# EAGLE design Rocky Switch Relay (EAGLE 8.2.1)
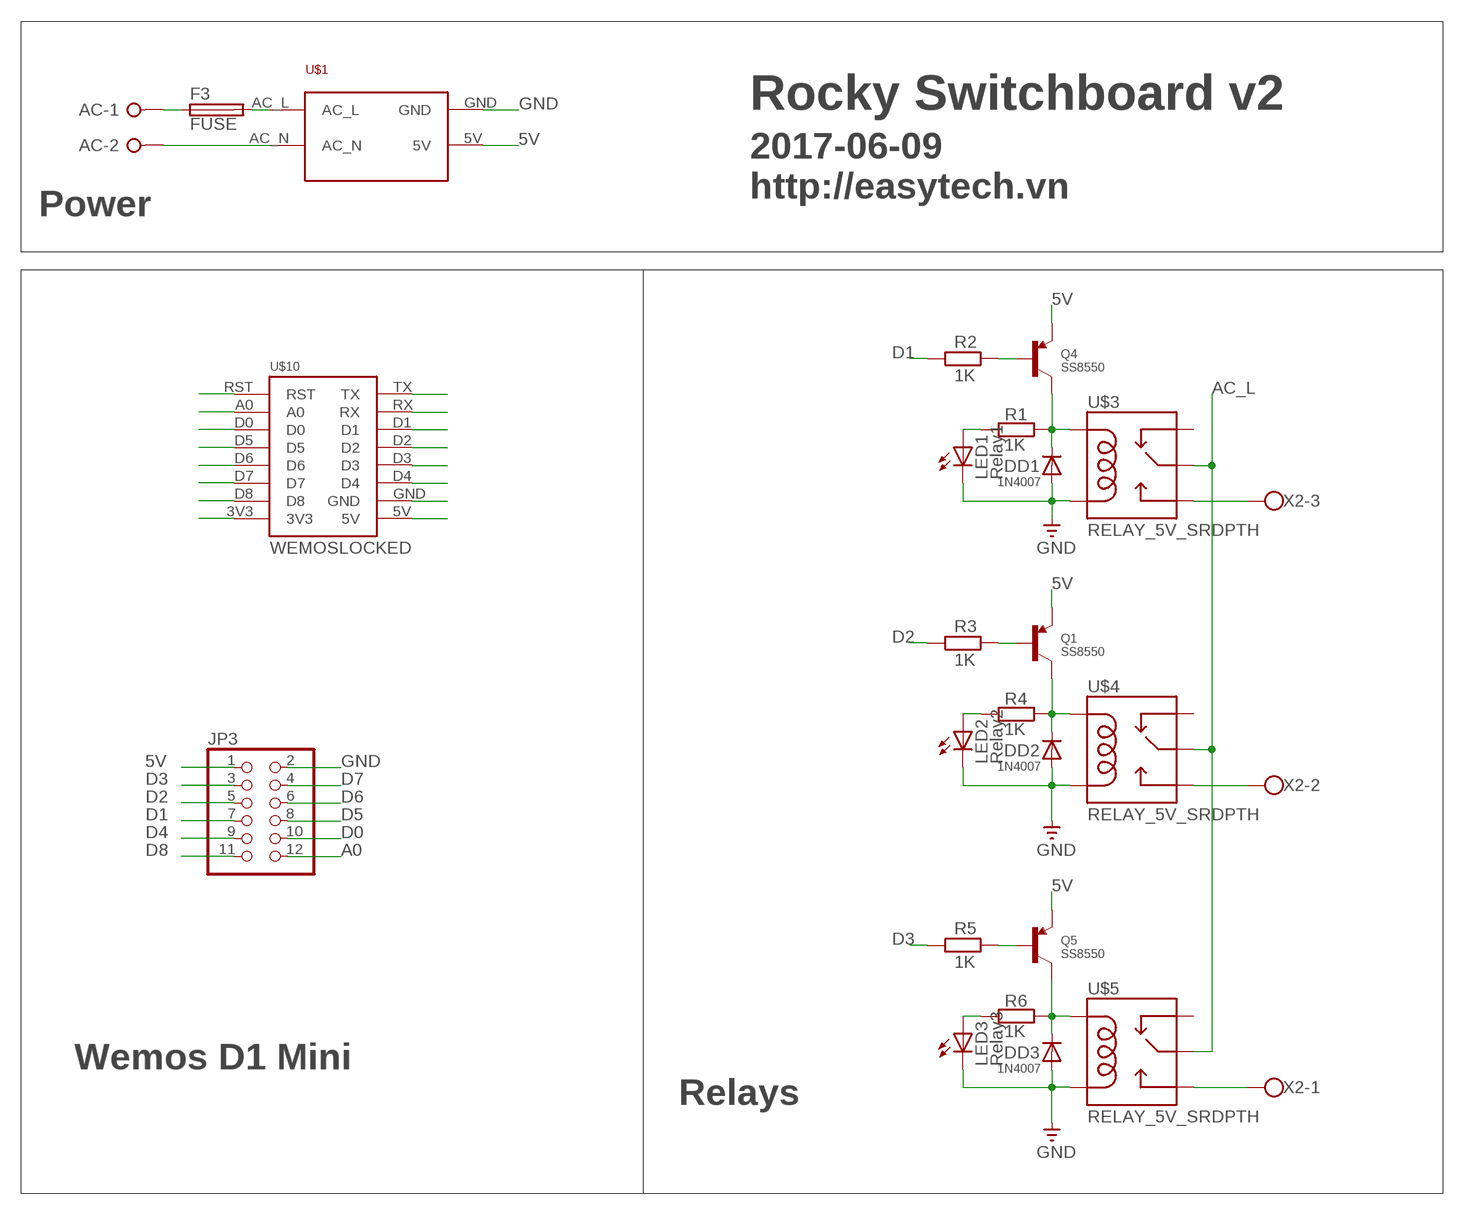
[diagram p0: schematic, sheet 1]

## Parts
AC  W237-02P  [W237-132]
DD1  1N4007  DIODESMA  [SMADIODE]
DD2  1N4007  DIODESMA  [SMADIODE]
DD3  1N4007  DIODESMA  [SMADIODE]
F3  FUSE  FUSETE5  [TE5]
JP3  PINHD-2X6  [2X06]
LED1  Relay1  LEDCHIP-LED0805  [CHIP-LED0805]
LED2  Relay2  LEDCHIP-LED0805  [CHIP-LED0805]
LED3  Relay3  LEDCHIP-LED0805  [CHIP-LED0805]
Q1  SS8550  TRANSISTOR_PNPSOT23-WAVE  [SOT23-W]
Q4  SS8550  TRANSISTOR_PNPSOT23-WAVE  [SOT23-W]
Q5  SS8550  TRANSISTOR_PNPSOT23-WAVE  [SOT23-W]
R1  1K  R-EU_R0805  [R0805]
R2  1K  R-EU_R0805  [R0805]
R3  1K  R-EU_R0805  [R0805]
R4  1K  R-EU_R0805  [R0805]
R5  1K  R-EU_R0805  [R0805]
R6  1K  R-EU_R0805  [R0805]
U$1  POWER_SUPPLY_220VAC_5V  [POWER_SUPPLY_220VAC_5V]
U$3  RELAY_5V_SRDPTH  [SRD-05VDC-SL-C]
U$4  RELAY_5V_SRDPTH  [SRD-05VDC-SL-C]
U$5  RELAY_5V_SRDPTH  [SRD-05VDC-SL-C]
U$10  WEMOSLOCKED  [WEMOS_LOCKED]
X2  W237-103  [W237-103]

## Nets
3V3: U$10.3V3
5V: JP3.1 Q1.2(E) Q4.2(E) Q5.2(E) U$1.5V U$10.5V
A0: JP3.12 U$10.A0
AC_L: F3.2 U$1.AC_L U$3.SWCOMMON U$4.SWCOMMON U$5.SWCOMMON
AC_N: AC.2 U$1.AC_N
D0: JP3.10 U$10.D0
D1: JP3.7 R2.1 U$10.D1
D2: JP3.5 R3.1 U$10.D2
D3: JP3.3 R5.1 U$10.D3
D4: JP3.9 U$10.D4
D5: JP3.8 U$10.D5
D6: JP3.6 U$10.D6
D7: JP3.4 U$10.D7
D8: JP3.11 U$10.D8
GND: DD1.A DD2.A DD3.A JP3.2 LED1.C LED2.C LED3.C U$1.GND U$3.COIL0 U$4.COIL0 U$5.COIL0 U$10.GND
N$1: DD2.C Q1.3(C) R4.1 U$4.COIL1
N$3: U$3.SWOPEN X2.3
N$4: LED1.A R1.2
N$5: DD3.C Q5.3(C) R6.1 U$5.COIL1
N$6: Q1.1(B) R3.2
N$7: Q4.1(B) R2.2
N$8: LED2.A R4.2
N$9: U$4.SWOPEN X2.2
N$11: Q5.1(B) R5.2
N$12: LED3.A R6.2
N$13: U$5.SWOPEN X2.1
N$14: AC.1 F3.1
N$20: DD1.C Q4.3(C) R1.1 U$3.COIL1
RST1: U$10.RST
RX: U$10.RX
TX: U$10.TX
Unconnected: U$3.SWCLOSED(SWCLOSE) U$4.SWCLOSED(SWCLOSE) U$5.SWCLOSED(SWCLOSE)

## Notes on the sheet
- Rocky Switchboard v2
- 2017-06-09
  http://easytech.vn
- Power
- Wemos D1 Mini
- Relays

## Library data of the parts
AC = con-wago-508:W237-02P: WAGO SREW CLAMP; OC_FARNELL: unknown; OC_NEWARK: unknown
DD1-DD3 = adafruit:DIODE: Diode SMADIODE - SMA Surface Mount Package 20V 1A Schottky Diode Digikey: 641-1014-6-ND DO-1N4148 - Through Hole Small Current Diode SOD-123 20V 1 A (.5mV Vf) Schottky Diode - Digikey: MBRX120TPMSCT-ND SOD-323 10V 570mA (.38mV Vf, 3ns) Schottky Diode - Digikey: ZLLS410CT-ND SOD-523 30V 30mA Schottky Diode (RB751S-40TE61) - Digikey: RB751S-40TE61CT-ND SOT23-R/W - SOT23 Package (R = Solder Paste/Reflow Ovens, W = Hand-Soldering) BAT54Film 40V 300mA - Digikey: 497-7162-1-ND
F3 = fuse:FUSE: Fuse; OC_FARNELL: unknown; OC_NEWARK: unknown
JP3 = pinhead:PINHD-2X6: PIN HEADER
LED1-LED3 = adafruit:LED: LED OSRAM: - CHIPLED LG R971, LG N971, LY N971, LG Q971, LY Q971, LO R971, LY R971 LH N974, LH R974 LS Q976, LO Q976, LY Q976 LO Q996 - Hyper CHIPLED LW Q18S LB Q993, LB Q99A, LB R99A - SideLED LS A670, LO A670, LY A670, LG A670, LP A670 LB A673, LV A673, LT A673, LW A673 LH A674 LY A675 LS A676, LA A676, LO A676, LY A676, LW A676 LS A679, LY A679, LG A679 - Hyper Micro SIDELED® LS Y876, LA Y876, LO Y876, LY Y876 LT Y87S - SmartLED LW L88C, LW L88S LB L89C, LB L89S, LG L890 LS L89K, LO L89K, LY L89K LS L896, LA L896, LO L896, LY L896 - TOPLED LS T670, LO T670, LY T670, LG T670, LP T670 LSG T670, LSP T670, LSY T670, LOP T670, LYG T670 LG T671, LOG T671, LSG T671 LB T673, LV T673, LT T673, LW T673 LH T674 LS T676, LA T676, LO T676, LY T676, LB T676, LH T676, LSB T676, LW T676 LB T67C, LV T67C, LT T67C, LS T67K, LO T67K, LY T67K, LW E67C LS E67B, LA E67B, LO E67B, LY E67B, LB E67C, LV E67C, LT E67C LW T67C LS T679, LY T679, LG T679 LS T770, LO T770, LY T770, LG T770, LP T770 LB T773, LV T773, LT T773, LW T773 LH T774 LS E675, LA E675, LY E675, LS T675 LS T776, LA T776, LO T776, LY T776, LB T776 LHGB T686 LT T68C, LB T68C - Hyper Mini TOPLED® LB M676 - Mini TOPLED Santana® LG M470 LS M47K, LO M47K, LY M47K Source: http://www.osram.convergy.de/
Q1 Q4 Q5 = microbuilder:TRANSISTOR_PNP: PNP Transistor Transistor (PNP) 800mA 60V, 1.6V VCE @ 500mA [Digikey: MMBT2907AFSTR-ND] Transistor (PNP) Low Sat - 1.5A 20V, 260mV VCE @ 400mA [Digikey: ZXTP25020DFLTR-ND] SOT23-R - SOT23 footprint optimised for use with solder paste and reflow ovens. SOT23-W - SOT23 footprint optimised for hand-soldering (larger pads).
R1-R6 = rcl:R-EU_: RESISTOR, European symbol
U$1 = My Eagle Lib:POWER_SUPPLY_220VAC_5V
U$3-U$5 = My-Eagle-Lib:RELAY_5V_SRD: SPDT relay (COM-00101)
U$10 = My Eagle Lib:WEMOS
X2 = con-wago-500:W237-103: WAGO SCREW CLAMP; MPN: 237-103; OC_FARNELL: unknown; OC_NEWARK: 18M7116

## Board
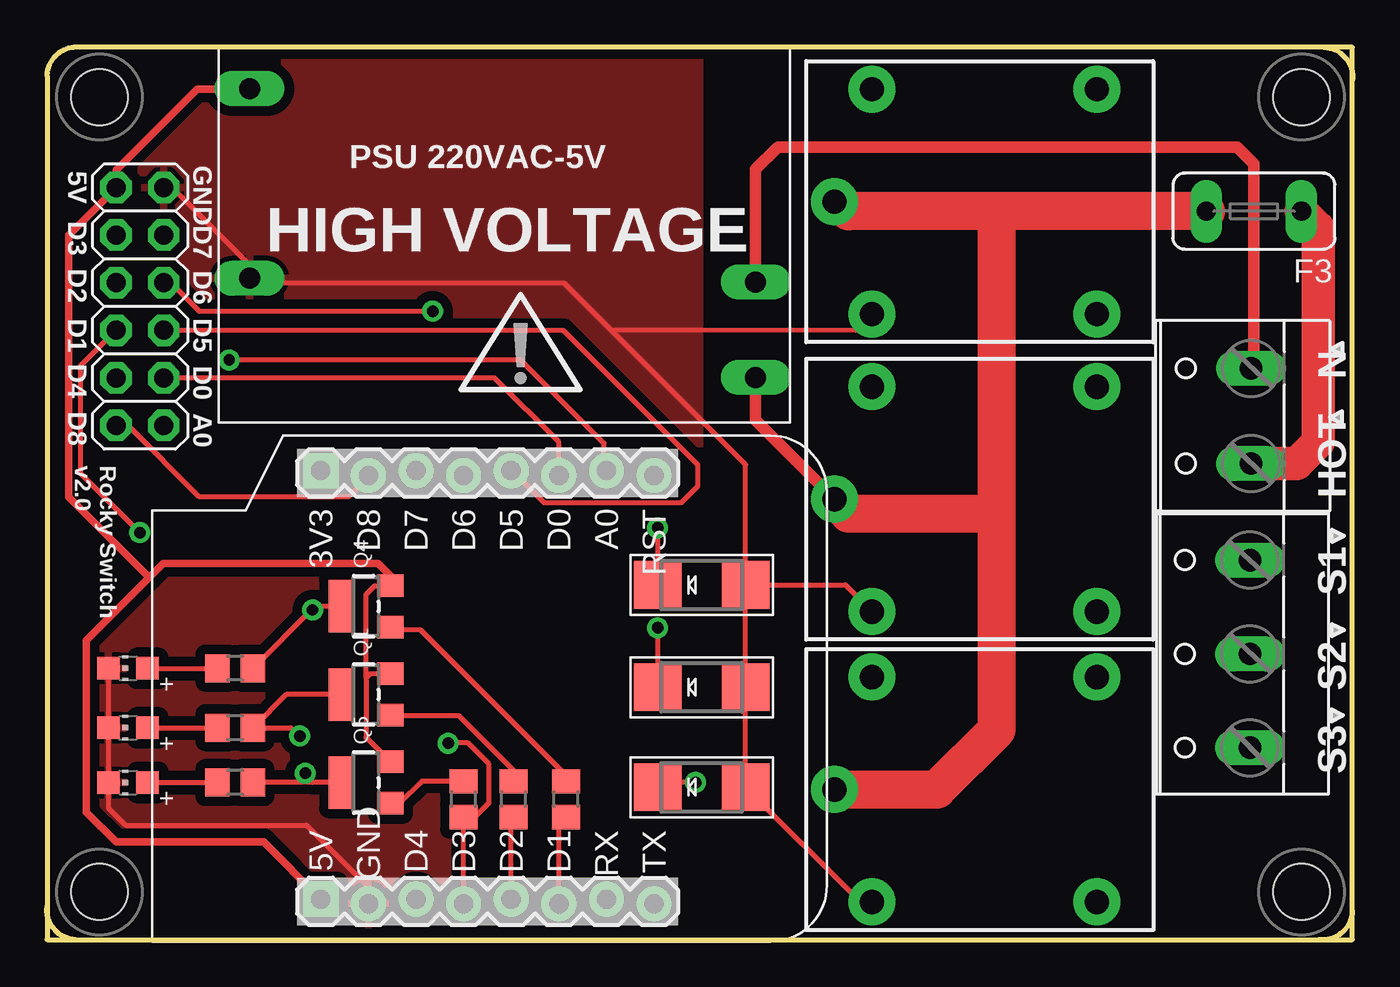
[diagram p1: board, top side]
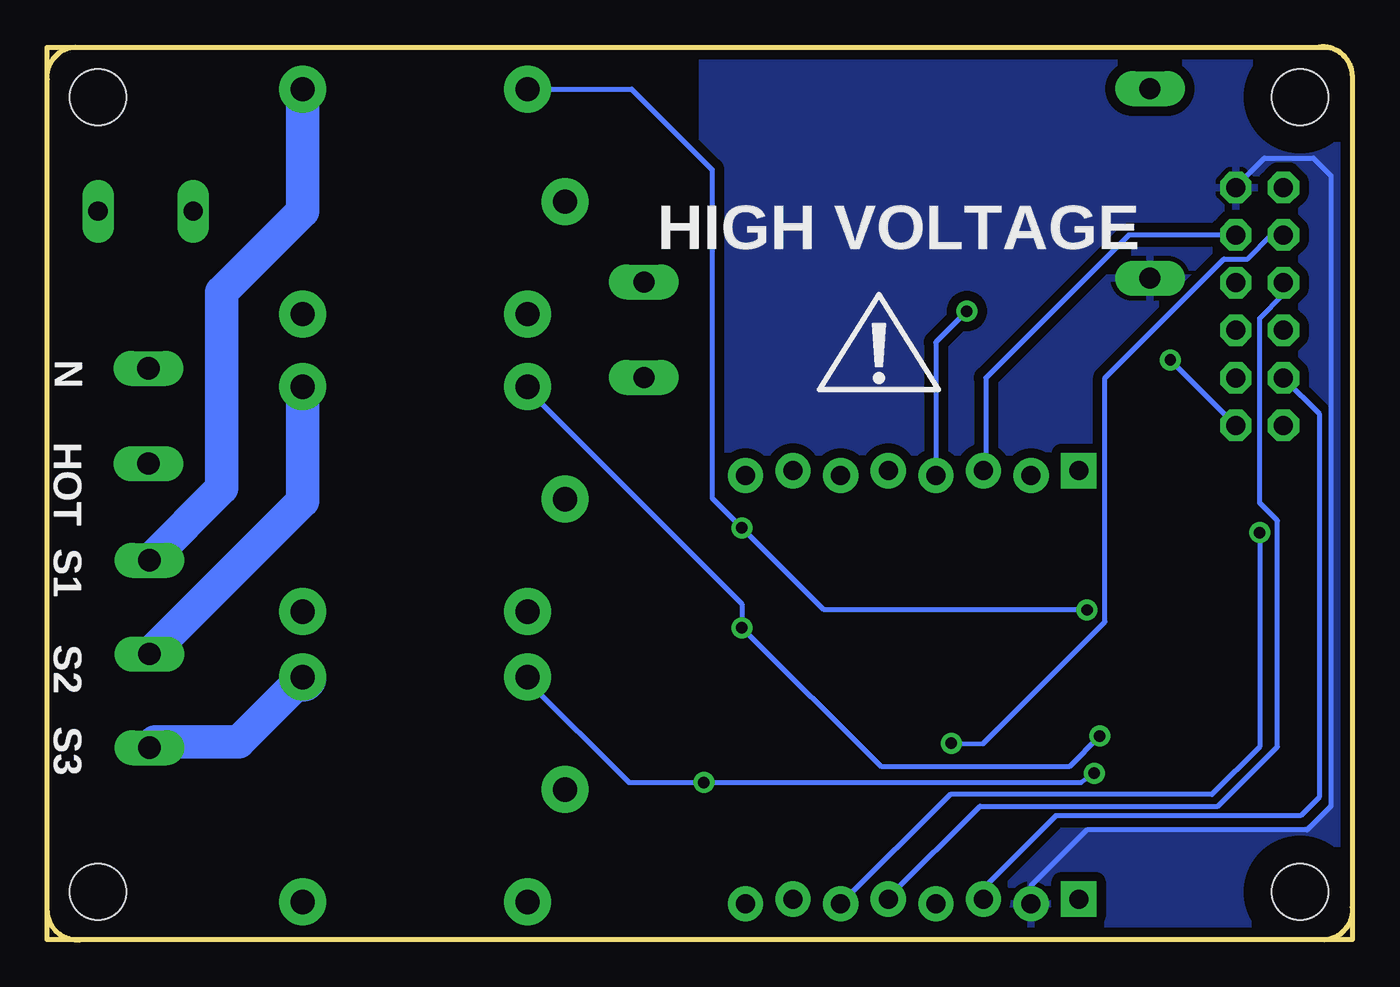
[diagram p2: board, bottom side, seen from below]

Size 69.67 x 47.65 mm. Coordinates in mm from the lower left corner, seen from the top.
Outline: 1.53,0.01 0.01,0.01 0.01,1.79
Outline: 1.53,0.01 67.88,0.01
Outline: 67.88,0.01 69.66,0.01 69.66,47.63 1.41,47.63
Outline: 0.01,1.79 0.01,46.11 arc-95 1.79,47.64
Outline: 68.13,47.62 arc-95 69.66,45.86
Outline: 69.66,1.53 arc-95 67.88,0.01
Outline: 1.53,0.01 arc-95 0.01,1.79
Copper layers (1*16): Top 0.035mm / dielectric 1.5mm / Bottom 0.035mm
Design rules "default *": minimum track width 10mil, minimum drill 24mil, track to track 10mil, track to pad 10mil, pad to pad 10mil, via to via 10mil, smd to smd 8mil, copper to edge 20mil, drill to drill 12mil, minimum pad ring 13mil, minimum via ring 10mil, stop-mask expansion 4mil, vias tented up to drill 0mil, thermal gap 10mil

### Footprints (pad centres in the part's own frame; a part is rotated, then mirrored left to right if it is on the bottom)
W237-132 = drill 1.194 long: 1 -2.54,-0.635; 2 2.54,-0.635
SMADIODE = smd 2.54 x 2.54: A 2.349,0; C -2.349,0
TE5 = drill 1.016 long: 1 -2.54,0; 2 2.54,0
2X06 = drill 1.016 octagon: 1 -6.35,-1.27; 2 -6.35,1.27; 3 -3.81,-1.27; 4 -3.81,1.27; 5 -1.27,-1.27; 6 -1.27,1.27; 7 1.27,-1.27; 8 1.27,1.27; 9 3.81,-1.27; 10 3.81,1.27; 11 6.35,-1.27; 12 6.35,1.27
CHIP-LED0805 = smd 1.2 x 1.2: A 0,-1.05; C 0,1.05
SOT23-W = smd 1.2 x 1.4: 1 -1.1,-1.3; 2 1.1,-1.3 | smd 2.8 x 1.4: 3 0,1.3
R0805 = smd 1.3 x 1.5: 1 -0.95,0; 2 0.95,0
POWER_SUPPLY_220VAC_5V = drill 1.118 pad 1.88 long: 5V 13.2,-7.82; AC_L -13.8,7.6; AC_N -13.8,2.5; GND 13.2,2.3
SRD-05VDC-SL-C = drill 1.3 pad 2.5: COIL0 -5.39,-6.12; COIL1 -5.39,5.88; SWCLOSED 6.61,-6.12; SWCOMMON -7.39,-0.12; SWOPEN 6.61,5.88
KFH-M3 = hole 3: 0,0
WEMOS_LOCKED = drill 1.016 pad 1.88 square: 3V3 -0.127,0; 5V 22.733,0 | drill 1.016 pad 1.88: A0 -0.127,15.24; D0 0.127,12.7; D1 22.987,12.7; D2 22.733,10.16; D3 22.987,7.62; D4 22.733,5.08; D5 -0.127,10.16; D6 0.127,7.62; D7 -0.127,5.08; D8 0.127,2.54; GND 22.987,2.54; RST 0.127,17.78; RX 22.733,15.24; TX 22.987,17.78
W237-103 = drill 1.194 long: 1 -5,-1.29; 2 0,-1.29; 3 5,-1.29

### Placement (x,y rotation side)
AC  63.61,27.95 90 top
DD1  34.94,18.93 0 top
DD2  34.94,13.47 0 top
DD3  34.94,8.14 0 top
F3  64.4,38.87 180 top
JP3  4.96,33.79 270 top
LED1  4.33,14.49 90 top
LED2  4.33,11.31 90 top
LED3  4.33,8.39 90 top
Q1  17.03,13.09 90 top
Q4  17.03,17.79 90 top
Q5  17.03,8.39 90 top
R1  10.04,14.49 180 top
R2  27.7,7.5 90 top
R3  24.9,7.5 90 top
R4  10.04,11.31 180 top
R5  22.24,7.5 90 top
R6  10.04,8.39 180 top
U$1  24.01,37.6 180 top
U$2  [ICON_EXL-S]  25.28,31.25 0 bottom
U$3  49.41,39.51 0 top
U$4  49.41,23.63 0 top
U$5  49.41,8.14 0 top
U$6  [KFH-M3]  2.8,2.55 0 top
U$7  [KFH-M3]  66.94,2.55 0 top
U$8  [KFH-M3]  66.94,44.97 0 top
U$9  [KFH-M3]  2.8,44.97 0 top
U$10  14.62,24.9 270 top
U$11  [ICON_PIN1_B]  68.49,31.53 0 top
U$12  [ICON_PIN1_B]  68.46,27.87 0 top
U$13  [ICON_PIN1_B]  69.2,21.55 180 top
U$14  [ICON_PIN1_B]  69.2,16.52 180 top
U$15  [ICON_PIN1_B]  69.15,11.97 180 top
U$17  [ICON_EXL-S]  25.28,31.25 0 top
X2  62.9,15.25 90 top

### Tracks (layer width: path | path; a pad name or v marks a point on that pad's centre or on a via)
5V
  Top 0.254: Q4.2 17.49,18.89 17.03,18.43 17.03,13.98 | 17.03,13.98 17.03,10.79 Q5.2 | Q1.2 17.24,14.19 17.03,13.98 | U$10.5V 14.49,2.36
  Top 0.406: U$1.5V 10.77,45.37 8.01,45.37 3.69,41.06 JP3.1 1.15,37.6 1.15,23.63 5.46,19.33 | U$10.5V 11.57,5.22 3.69,5.22 2.11,6.81 2.11,15.97 5.46,19.33 | Q4.2 18.33,19.41 17.66,20.08 6.21,20.08 5.46,19.33
A0  (via drill 0.61)
  Top 0.254: v9.73,30.93 25.28,30.93 29.73,26.49 29.73,25.22 U$10.A0
  Bottom 0.254: v9.73,30.93 JP3.12
AC_L
  Top 0.61: U$4.SWCOMMON 37.81,27.72 U$1.AC_L
  Top 1.778: U$3.SWCOMMON 42.14,39.51 42.78,38.87
  Top 2.032: 50.68,22.74 42.79,22.74 U$4.SWCOMMON | 50.68,22.74 50.68,11.21 47.49,8.02 U$5.SWCOMMON | F3.2 50.68,38.87 | 50.68,22.74 50.68,38.87 | 50.68,38.87 42.78,38.87
AC_N
  Top 0.61: AC.2 64.4,30.64 64.4,41.41 63.51,42.3 39,42.3 37.81,41.12 U$1.AC_N
  Top 1.016: 37.98,35.27 U$1.AC_N
D0
  Top 0.254: U$10.D0 27.32,26.55 23.89,29.98 JP3.10
D1  (via drill 0.61)
  Top 0.254: JP3.7 1.79,30.62 1.79,24.9 v4.96,21.73 | U$10.D1 27.32,6.17 R2.1
  Bottom 0.254: v4.96,21.73 4.96,10.3 7.5,7.76 21.47,7.76 U$10.D1
D2
  Top 0.254: U$10.D2 24.78,6.43 R3.1
  Bottom 0.254: JP3.5 3.69,34.43 4.96,33.16 4.96,23.31 4.01,22.36 4.01,10.3 7.19,7.12 19.89,7.12 24.65,2.36 U$10.D2
D3  (via drill 0.61)
  Top 0.254: U$10.D3 R5.1 | 22.43,6.49 R5.1 | R5.1 22.83,6.55 23.58,7.3 23.58,9.38 22.46,10.5 v21.42,10.5 v21.41,10.49
  Bottom 0.254: JP3.3 4.33,37.6 5.6,36.33 6.87,36.33 13.22,29.98 13.22,16.97 19.72,10.46 v21.41,10.49
D4
  Bottom 0.254: 19.7,2.3 U$10.D4 19.7,2.75 15.83,6.61 2.78,6.61 1.79,7.61 1.79,28.08 JP3.9
D5
  Top 0.254: U$10.D5 24.97,24.9 26.55,23.31 33.84,23.31 34.72,24.19 34.72,25.35 27.54,32.52 JP3.8
D6  (via drill 0.61)
  Top 0.254: JP3.6 6.61,35.06 8.14,33.54 v20.58,33.54
  Bottom 0.254: v20.58,33.54 22.24,31.89 U$10.D6
D7
  Bottom 0.254: JP3.4 11.95,37.6 19.57,29.98 19.57,25.16 U$10.D7
D8
  Top 0.254: JP3.11 4.33,27.44 8.14,23.63 16.08,23.63 17.03,24.58 U$10.D8
GND
  Top 0.254: JP3.2 6.69,40.14 10.83,36 10.83,35.32 U$1.GND 11.06,35.06 27.57,35.06 30.08,32.55 | LED1.C LED2.C LED3.C 3.28,7.03 4.2,6.11 13.85,6.11 17.16,2.8 U$10.GND | 30.08,32.55 43.16,32.52 U$3.COIL0 | DD1.A DD2.A DD3.A 43.41,2.02 U$5.COIL0 | DD1.A 42.6,18.93 U$4.COIL0 | 30.08,32.55 37.28,25.35 DD1.A
  Bottom 0.254: JP3.2 6.23,40.19 4.71,41.72 2.09,41.72 1.15,40.78 1.15,7.12 2.42,5.85 14.18,5.85 17.16,2.88 U$10.GND
  pour Bottom (isolate 0.508): 34.68,56.27 -15.1,55.89 -15.1,-3.8 34.68,-3.42
  pour Top (isolate 0.508): 34.81,56.14 -15.1,55.89 -15.1,-3.8 34.81,-3.55
N$1  (via drill 0.61)
  Top 0.254: v32.59,16.65 DD2.C | 15.76,12.84 Q1.3 12.77,13.09 R4.1 13.03,11.31 v13.5,10.87
  Bottom 0.254: U$4.COIL1 44.02,29.35 32.59,17.92 v32.59,16.65 25.17,9.26 15.09,9.26 v13.5,10.87
N$3
  Bottom 1.778: U$3.SWOPEN 56.02,38.87 60.34,34.55 60.34,24.11 X2.3
N$4
  Top 0.254: LED1.A R1.2
N$5  (via drill 0.61)
  Top 0.254: Q5.3 14.17,8.39 | 14.17,8.39 R6.1 | v34.62,8.39 32.59,8.39 DD3.C | v13.79,8.89 14.17,8.39
  Bottom 0.254: U$5.COIL1 44.02,13.79 38.62,8.39 v34.62,8.39 14.49,8.39 v13.79,8.89
N$6
  Top 0.254: R3.2 24.9,9.03 21.98,11.95 18.37,11.95 Q1.1
N$7
  Top 0.254: R2.2 27.7,8.77 19.95,16.52 18.5,16.52 Q4.1
N$8
  Top 0.254: LED2.A R4.2
N$9
  Bottom 1.778: X2.2 56.02,23.42 U$4.SWOPEN
N$11
  Top 0.254: R5.2 20.01,8.45 19.89,8.33 18.93,7.38 18.41,7.38 Q5.1
N$12
  Top 0.254: LED3.A R6.2
N$13
  Bottom 1.778: 56.02,13.97 59.45,10.55 63.89,10.55 X2.1
  Bottom 2.54: U$5.SWOPEN 56.02,13.97
N$14
  Top 1.778: AC.1 66.69,25.41 67.83,26.55 67.83,37.98 F3.1
N$20  (via drill 0.61)
  Top 0.254: Q4.3 14.3,17.79 14.14,17.63 | 14.14,17.63 R1.1 | v32.59,21.98 DD1.C | v14.17,17.6 14.14,17.63
  Bottom 0.254: v32.59,21.98 32.61,22.06 | v32.59,21.98 28.2,17.6 v14.17,17.6 | v32.59,21.98 34.17,23.57 34.17,41.1 38.47,45.39 U$3.COIL1

### Text on the board
tNames: GND | 5V | PSU 220VAC-5V | D3 | D7 | HIGH VOLTAGE | D2 | D6 | D1 | D5 | D4 | D0 | N | D8 | A0 | Rocky Switch / v2.0 | HOT | S1 | S2 | S3
bNames: HIGH VOLTAGE | N | HOT | S1 | S2 | S3